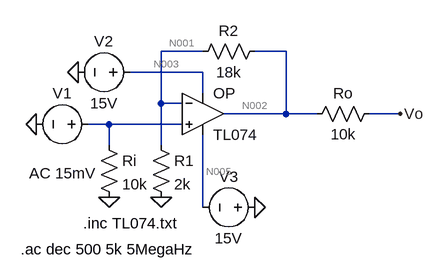
[diagram p0: schematic 4_2_1_b.asc]
4_2_1_b.asc, the LTspice schematic file:
Version 4
SHEET 1 880 680
WIRE 256 32 192 32
WIRE 384 32 336 32
WIRE 256 64 144 64
WIRE 256 96 256 64
WIRE 192 112 192 32
WIRE 224 112 192 112
WIRE 384 128 384 32
WIRE 384 128 288 128
WIRE 432 128 384 128
WIRE 560 128 512 128
WIRE 112 144 80 144
WIRE 224 144 112 144
WIRE 112 176 112 144
WIRE 192 176 192 112
WIRE 256 272 256 160
FLAG 192 256 0
FLAG 112 256 0
FLAG 336 272 0
FLAG 64 64 0
FLAG 0 144 0
FLAG 560 128 Vo
SYMBOL res 352 16 R90
WINDOW 0 0 56 VBottom 2
WINDOW 3 32 56 VTop 2
SYMATTR InstName R2
SYMATTR Value 18k
SYMBOL res 176 160 R0
SYMATTR InstName R1
SYMATTR Value 2k
SYMBOL res 96 160 R0
SYMATTR InstName Ri
SYMATTR Value 10k
SYMBOL res 528 112 R90
WINDOW 0 0 56 VBottom 2
WINDOW 3 32 56 VTop 2
SYMATTR InstName Ro
SYMATTR Value 10k
SYMBOL voltage 96 144 R90
WINDOW 0 -32 56 VBottom 2
WINDOW 3 32 56 VTop 2
WINDOW 123 60 56 VTop 2
WINDOW 39 0 0 Left 0
SYMATTR InstName V1
SYMATTR Value ""
SYMATTR Value2 AC 15mV
SYMBOL voltage 160 64 R90
WINDOW 0 -32 56 VBottom 2
WINDOW 3 32 56 VTop 2
SYMATTR InstName V2
SYMATTR Value 15V
SYMBOL voltage 352 272 R90
WINDOW 0 -32 56 VBottom 2
WINDOW 3 32 56 VTop 2
SYMATTR InstName V3
SYMATTR Value 15V
SYMBOL Opamps\\opamp2 256 64 R0
SYMATTR InstName OP
SYMATTR Value TL074
TEXT 72 296 Left 2 !.inc TL074.txt
TEXT -24 336 Left 2 !.ac dec 500 5k 5MegaHz

The netlist it stands for:
* 4_2_1_b.asc
R2 N002 N001 18k
R1 N001 0 2k
Ri N004 0 10k
Ro Vo N002 10k
V1 N004 0 AC 15mV
V2 N003 0 15V
V3 0 N005 15V
XOP N004 N001 N003 N005 N002 TL074  ; pins In+ In- V+ V- OUT
.inc TL074.txt
.ac dec 500 5k 5MegaHz
.backanno
.end

* Results of the author's LTspice run, read from the files saved beside the schematic
* Operating Point, zero values left out:
*   V(n002) = 110.5 µV
*   V(n001) = 10.97 µV
*   V(vo) = 110.5 µV
*   V(n003) = 15 V
*   V(n005) = -15 V
*   I(R1) = 5.485 nA
*   I(R2) = 5.53 nA
*   I(V3) = -14.19 mA
*   I(V2) = -14.19 mA
*   I(V1) = -45.05 pA
*   Ix(op:1) = 45.05 pA
*   Ix(op:2) = 45.05 pA
*   Ix(op:3) = 14.19 mA
*   Ix(op:4) = -14.19 mA
*   Ix(op:5) = -5.53 nA
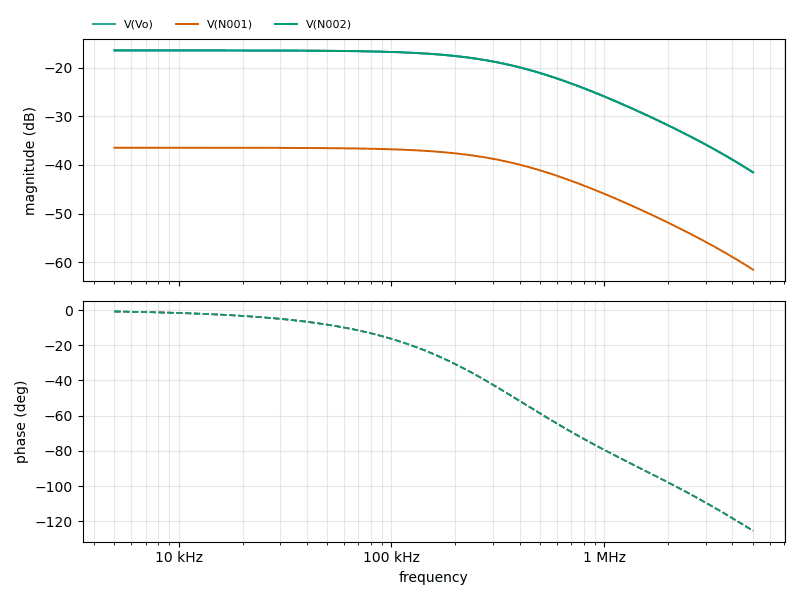
[diagram p1: AC Analysis of 4_2_1_b.asc, plotted from the saved traces]
* AC Analysis, 1 run:
*   V(Vo): -16.48 dB at 5 kHz, -41.54 dB at 5 MHz, peak -16.48 dB at 5 kHz, 3 dB below the peak at 361.3 kHz
*   V(N001): -36.48 dB at 5 kHz, -61.54 dB at 5 MHz, peak -36.48 dB at 5 kHz, 3 dB below the peak at 361.3 kHz
*   V(N002): -16.48 dB at 5 kHz, -41.54 dB at 5 MHz, peak -16.48 dB at 5 kHz, 3 dB below the peak at 361.3 kHz